# EasyEDA schematic EasyEDA circuit diagram.json
TITLE: Stepper Motor Manual Tester; REV: 1.0; Date: 2023-03-20; Sheet: 1/1; Company: ITU TAM
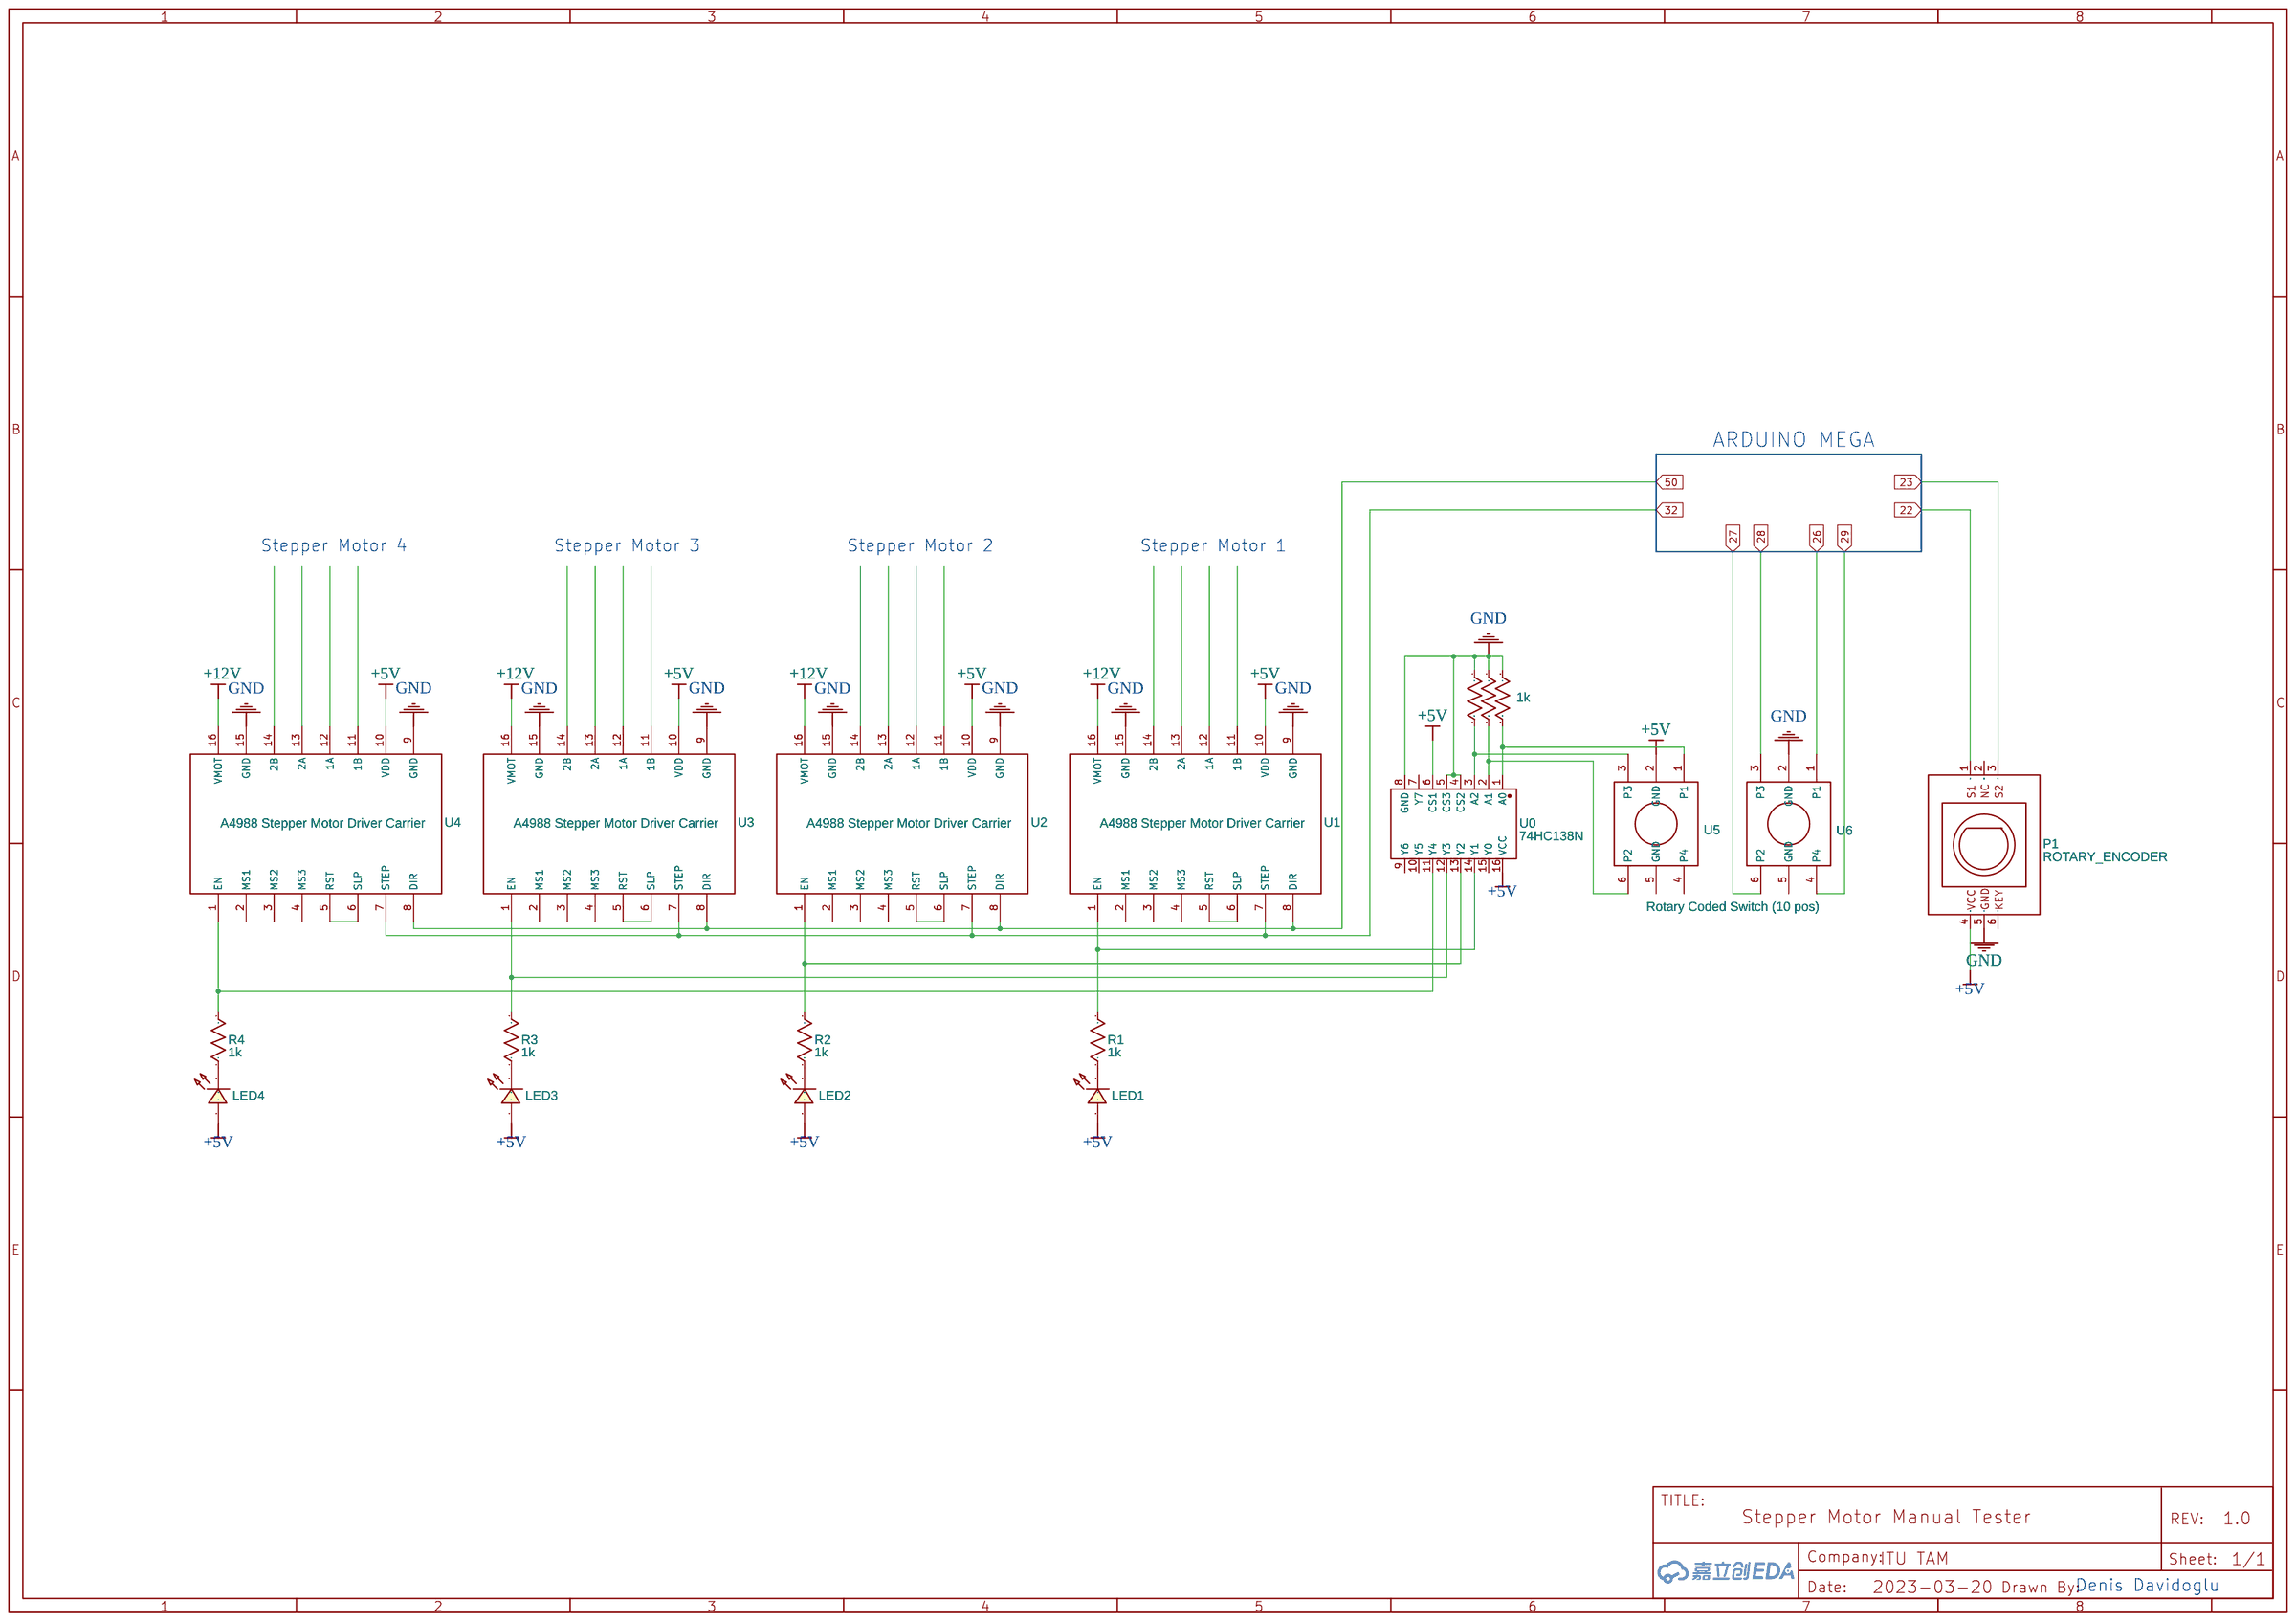
[diagram p0: schematic sheet]

## Parts
LED1  LED-0603_R  [LED0603_RED]
LED2  LED-0603_R  [LED0603_RED]
LED3  LED-0603_R  [LED0603_RED]
LED4  LED-0603_R  [LED0603_RED]
P1  ROTARY_ENCODER  [5_PIN_KY-040_ROTARY_ENCODER_HEADER]
R1  1k  [R0603]
R2  1k  [R0603]
R3  1k  [R0603]
R4  1k  [R0603]
R5  1k  [R0603]
R6  1k  [R0603]
R7  1k  [R0603]
U0  74HC138N  [DIP-16_L19.2-W6.6-P2.54-LS7.6-BL]
U1  A4988 Stepper Motor Driver Carrier  [A4988 STEPPER MOTOR DRIVER CARRIER]
U2  A4988 Stepper Motor Driver Carrier  [A4988 STEPPER MOTOR DRIVER CARRIER]
U3  A4988 Stepper Motor Driver Carrier  [A4988 STEPPER MOTOR DRIVER CARRIER]
U4  A4988 Stepper Motor Driver Carrier  [A4988 STEPPER MOTOR DRIVER CARRIER]
U5  Rotary Coded Switch (10 pos)
U6  Rotary Coded Switch (10 pos)

## Library data of the parts
LED1-LED4 = LED-0603_R: Manufacturer: EVERLIGHT(台湾亿光); Manufacturer Part: 19-217/R6C-AL1M2VY/3T; Supplier Part: C72044; Supplier: LCSC; Contributor: LCEDA_01
P1 = KY-040_ROTARY_ENCODER2_ZOS: Manufacturer Part: Female header/2.54mm2x3 Female header; Contributor: zossoste
R1-R7 = R_0603_US: Contributor: LCEDA_Lib
U0 = 74HC138N: Supplier: LCSC; Supplier Part: C507188; Manufacturer: HGSEMI(华冠); Contributor: LCSC; JLCPCB Part Class: Extended Part
U1-U4 = A4988 Stepper Motor Driver Carrier: Contributor: winter2015; sourceId: YsmgyP7pj
U5 U6 = Rotary Coded Switch (16 pos): Contributor: Andreas Krügersen

## Nets
+5V: LED1.1 LED2.1 LED3.1 LED4.1 P1.4(GND) U0.6(CS1) U0.16(VCC) U1.10(VDD) U2.10(VDD) U3.10(VDD) U4.10(VDD) U5.2(GND)
+12V: U1.16(VMOT) U2.16(VMOT) U3.16(VMOT) U4.16(VMOT)
GND: P1.5(GND) R5.1 R6.1 R7.1 U0.4(CS2) U0.5(CS3) U0.8(GND) U1.9(GND) U1.15(GND) U2.9(GND) U2.15(GND) U3.9(GND) U3.15(GND) U4.9(GND) U4.15(GND) U6.2(GND)
22: P1.1(GND)
23: P1.3(GND)
26: U6.1(P1)
27: U6.6(P2)
28: U6.3(P3)
29: U6.4(P4)
32: U1.7(STEP) U2.7(STEP) U3.7(STEP) U4.7(STEP)
50: U1.8(DIR) U2.8(DIR) U3.8(DIR) U4.8(DIR)
Net-(LED1-2): LED1.2 R1.1
Net-(LED2-2): LED2.2 R2.1
Net-(LED3-2): LED3.2 R3.1
Net-(LED4-2): LED4.2 R4.1
Net-(R1-2): R1.2 U0.14(Y1) U1.1(EN)
Net-(R2-2): R2.2 U0.13(Y2) U2.1(EN)
Net-(R3-2): R3.2 U0.12(Y3) U3.1(EN)
Net-(R4-2): R4.2 U0.11(Y4) U4.1(EN)
Net-(R5-2): R5.2 U0.3(A2) U5.3(P3)
Net-(R6-2): R6.2 U0.2(A1) U5.6(P2)
Net-(R7-2): R7.2 U0.1(A0) U5.1(P1)
Net-(U1-5): U1.5(RST) U1.6(SLP)
Net-(U2-5): U2.5(RST) U2.6(SLP)
Net-(U3-5): U3.5(RST) U3.6(SLP)
Net-(U4-5): U4.5(RST) U4.6(SLP)

Not connected (* = marked no-connect by the designer): P1 2(GND) 6(GND); U0 7(Y7) 9(Y6) 10(Y5) 15(Y0); U1 2(MS1) 3(MS2) 4(MS3) 11(1B) 12(1A) 13(2A) 14(2B); U2 2(MS1) 3(MS2) 4(MS3) 11(1B) 12(1A) 13(2A) 14(2B); U3 2(MS1) 3(MS2) 4(MS3) 11(1B) 12(1A) 13(2A) 14(2B); U4 2(MS1) 3(MS2) 4(MS3) 11(1B) 12(1A) 13(2A) 14(2B); U5 4(P4) 5(GND); U6 5(GND)

## Notes on the sheet
- ARDUINO MEGA
- Stepper Motor 4
- Stepper Motor 3
- Stepper Motor 2
- Stepper Motor 1
- Denis Davidoglu
